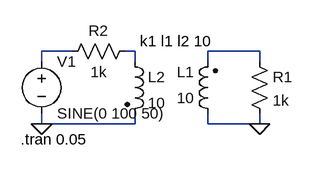
[diagram p0: schematic transformer.asc]
transformer.asc, the LTspice schematic file:
Version 4
SHEET 1 880 680
WIRE -32 112 -80 112
WIRE 64 112 48 112
WIRE 256 112 176 112
WIRE -80 128 -80 112
WIRE 64 128 64 112
WIRE 176 128 176 112
WIRE 256 128 256 112
WIRE -80 224 -80 208
WIRE 64 224 64 208
WIRE 64 224 -80 224
WIRE 176 224 176 208
WIRE 256 224 256 208
WIRE 256 224 176 224
FLAG 256 224 0
FLAG -80 224 0
SYMBOL res 240 112 R0
SYMATTR InstName R1
SYMATTR Value 1k
SYMBOL ind2 192 224 R180
WINDOW 0 36 80 Left 2
WINDOW 3 36 40 Left 2
SYMATTR InstName L1
SYMATTR Value 10
SYMATTR Type ind
SYMBOL ind2 48 112 R0
SYMATTR InstName L2
SYMATTR Value 10
SYMATTR Type ind
SYMBOL voltage -80 112 R0
WINDOW 123 0 0 Left 0
WINDOW 39 0 0 Left 0
SYMATTR InstName V1
SYMATTR Value SINE(0 100 50)
SYMBOL res 64 96 R90
WINDOW 0 0 56 VBottom 2
WINDOW 3 32 56 VTop 2
SYMATTR InstName R2
SYMATTR Value 1k
TEXT -112 248 Left 2 !.tran 0.05
TEXT 72 96 Left 2 !k1 l1 l2 10

The netlist it stands for:
* transformer.asc
R1 N003 0 1k
L1 0 N003 10
L2 N002 0 10
V1 N001 0 SINE(0 100 50)
R2 N002 N001 1k
.tran 0.05
k1 l1 l2 10
.backanno
.end